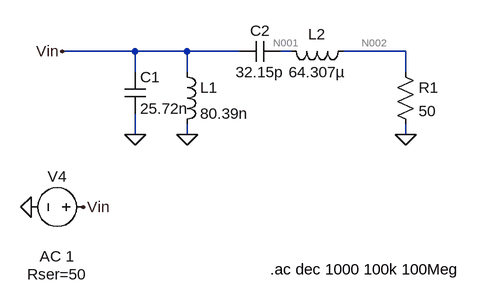
[diagram p0: schematic Circuit Theory Lab-5.asc]
Circuit Theory Lab-5.asc, the LTspice schematic file:
Version 4
SHEET 1 1780 680
WIRE 112 64 0 64
WIRE 192 64 112 64
WIRE 272 64 192 64
WIRE 352 64 336 64
WIRE 528 64 432 64
WIRE 112 96 112 64
WIRE 192 96 192 64
WIRE 528 96 528 64
WIRE 112 192 112 160
WIRE 192 192 192 176
WIRE 528 192 528 176
FLAG -48 304 0
FLAG 32 304 Vin
FLAG 0 64 Vin
FLAG 192 192 0
FLAG 112 192 0
FLAG 528 192 0
SYMBOL voltage 48 304 R90
WINDOW 0 -32 56 VBottom 2
WINDOW 3 32 56 VTop 2
WINDOW 123 60 56 VTop 2
WINDOW 39 88 56 VTop 2
SYMATTR InstName V4
SYMATTR Value ""
SYMATTR Value2 AC 1
SYMATTR SpiceLine Rser=50
SYMBOL cap 96 96 R0
SYMATTR InstName C1
SYMATTR Value 25.72n
SYMBOL ind 176 80 R0
SYMATTR InstName L1
SYMATTR Value 80.39n
SYMBOL cap 336 48 R90
WINDOW 0 0 32 VBottom 2
WINDOW 3 32 32 VTop 2
SYMATTR InstName C2
SYMATTR Value 32.15p
SYMBOL ind 448 48 R90
WINDOW 0 5 56 VBottom 2
WINDOW 3 32 56 VTop 2
SYMATTR InstName L2
SYMATTR Value 64.307µ
SYMBOL res 512 80 R0
SYMATTR InstName R1
SYMATTR Value 50
TEXT 320 400 Left 2 !.ac dec 1000 100k 100Meg

The netlist it stands for:
* Circuit Theory Lab-5.asc
V4 Vin 0 AC 1 Rser=50
C1 Vin 0 25.72n
L1 Vin 0 80.39n
C2 N001 Vin 32.15p
L2 N002 N001 64.307µ
R1 N002 0 50
.ac dec 1000 100k 100Meg
.backanno
.end

* Results of the author's LTspice run, read from the files saved beside the schematic
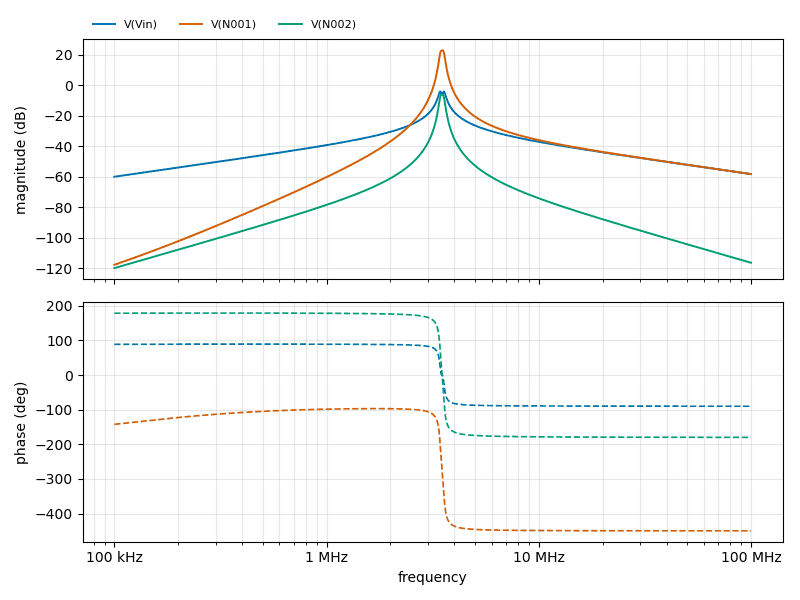
[diagram p1: AC Analysis of Circuit Theory Lab-5.asc, plotted from the saved traces]
* AC Analysis, 1 run:
*   V(Vin): -59.90 dB at 100 kHz, -58.14 dB at 100 MHz, peak -4.02 dB at 3.573 MHz, 3 dB below the peak at 3.362 MHz and 3.644 MHz
*   V(N001): -117.63 dB at 100 kHz, -58.13 dB at 100 MHz, peak 22.98 dB at 3.516 MHz, 3 dB below the peak at 3.416 MHz and 3.591 MHz
*   V(N002): -119.81 dB at 100 kHz, -116.28 dB at 100 MHz, peak -6.09 dB at 3.499 MHz, 3 dB below the peak at 3.414 MHz and 3.589 MHz